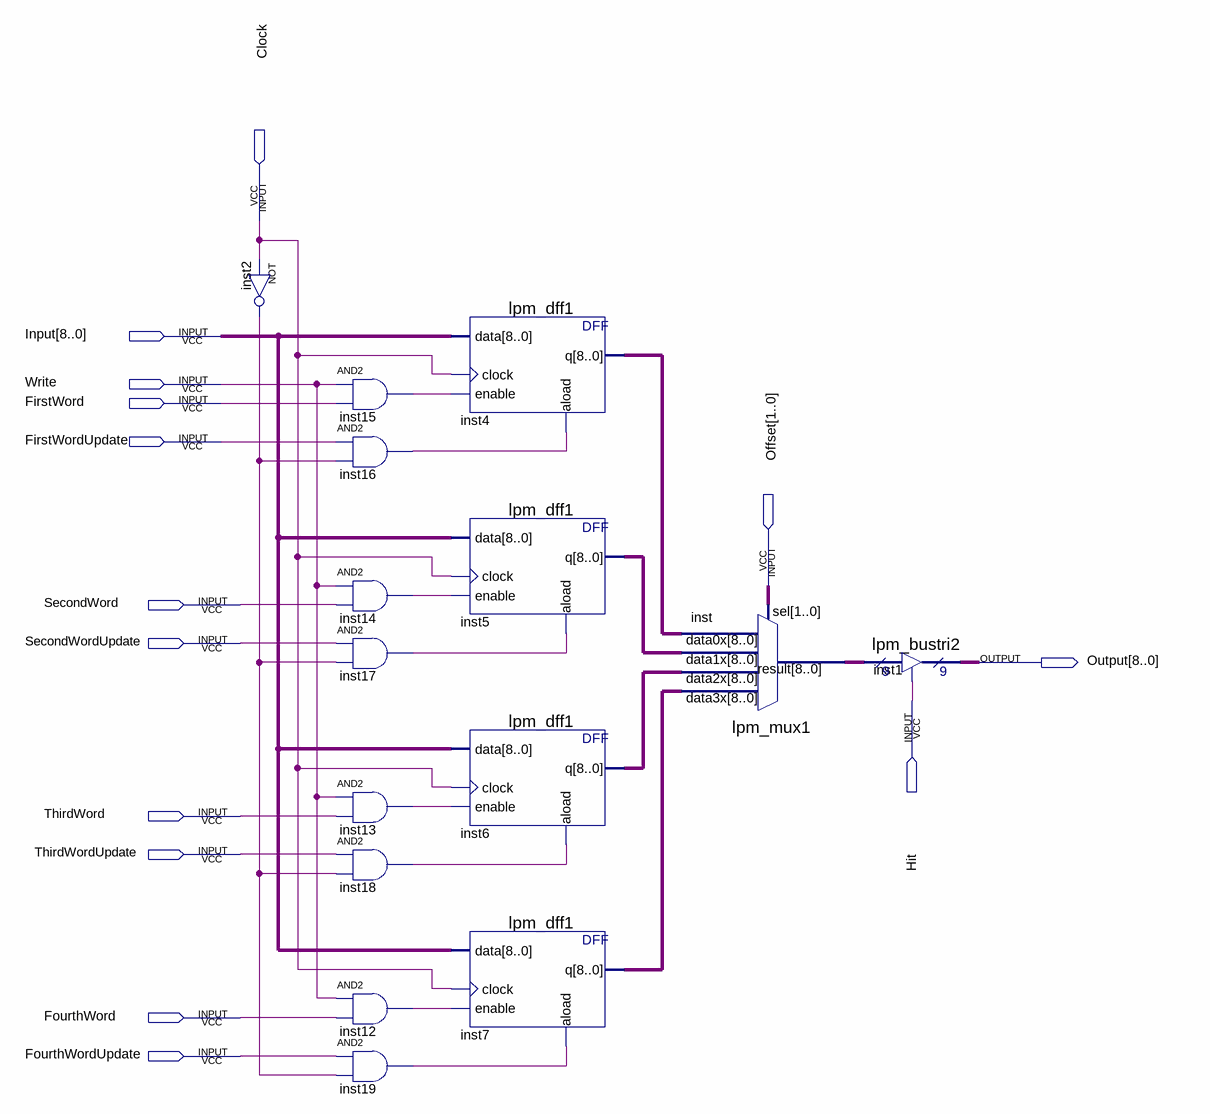
[diagram p0: schematic sheet]
// Quartus schematic RowBlock.bdf as structural Verilog: 15 symbols, 14 pins
module RowBlock (
  input  Clock,
  input  [8:0] Input,
  input  Write,
  input  FirstWord,
  input  FirstWordUpdate,
  input  [1:0] Offset,
  input  SecondWord,
  input  SecondWordUpdate,
  input  Hit,
  input  ThirdWord,
  input  ThirdWordUpdate,
  input  FourthWord,
  input  FourthWordUpdate,
  output [8:0] Output
);

  wire inst2_out, inst12_out, inst13_out, inst14_out, inst15_out, inst16_out, inst17_out, inst18_out,
       inst19_out;
  wire [8:0] inst4_q, inst5_q, inst6_q, inst7_q, inst_result;

  not inst2 (inst2_out, Clock);
  and inst15 (inst15_out, Write, FirstWord);
  and inst16 (inst16_out, FirstWordUpdate, inst2_out);
  and inst14 (inst14_out, Write, SecondWord);
  and inst17 (inst17_out, SecondWordUpdate, inst2_out);
  and inst13 (inst13_out, Write, ThirdWord);
  and inst18 (inst18_out, ThirdWordUpdate, inst2_out);
  and inst12 (inst12_out, Write, FourthWord);
  and inst19 (inst19_out, FourthWordUpdate, inst2_out);
  lpm_dff1 inst4 (.data(Input), .clock(Clock), .enable(inst15_out), .aload(inst16_out), .q(inst4_q));
  lpm_dff1 inst5 (.data(Input), .clock(Clock), .enable(inst14_out), .aload(inst17_out), .q(inst5_q));
  lpm_dff1 inst6 (.data(Input), .clock(Clock), .enable(inst13_out), .aload(inst18_out), .q(inst6_q));
  lpm_dff1 inst7 (.data(Input), .clock(Clock), .enable(inst12_out), .aload(inst19_out), .q(inst7_q));
  lpm_mux1 inst (
    .data3x(inst7_q), .data2x(inst6_q), .data1x(inst5_q), .data0x(inst4_q), .sel(Offset), .result(inst_result));
  lpm_bustri2 inst1 (.enabledt(Hit), .data(inst_result), .tridata(Output));
endmodule
